# Altium project QUTMS-PDM-V00.PrjPcb (part 2 of 2)
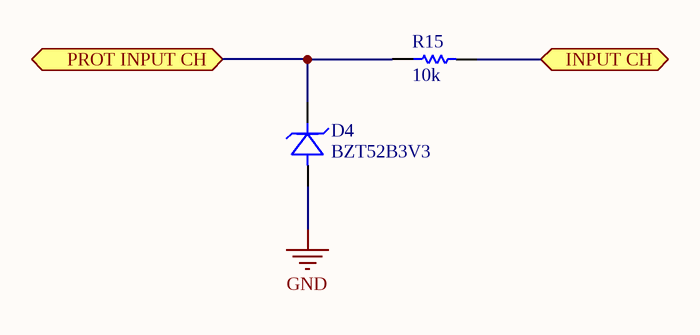
[diagram p12: PDM-S12-V00-InputProtection.SchDoc]

## Nets that join several sheets
3V3: PDM-S04-V00-Microcontroller (21 pins), PDM-S06-V00-CAN (C17.2 J3.1 U5.3), PDM-S03-V00-PSU (5 pins), PDM-S02-V00-BatteryProtection (C1.2 U1.6), PDM-S07-V00-PDMCConnectorInterface/PDM-S08-V00-PDMCConnector1 (H1A.F5), PDM-S07-V00-PDMCConnectorInterface/PDM-S08-V00-PDMCConnector2 (H1B.F5), PDM-S07-V00-PDMCConnectorInterface/PDM-S08-V00-PDMCConnector3 (H1C.F5), PDM-S07-V00-PDMCConnectorInterface/PDM-S08-V00-PDMCConnector4 (H1D.F5), PDM-S07-V00-PDMCConnectorInterface/PDM-S08-V00-PDMCConnector5 (H1E.F5), PDM-S07-V00-PDMCConnectorInterface/PDM-S08-V00-PDMCConnector6 (H1F.F5), PDM-S07-V00-PDMCConnectorInterface/PDM-S08-V00-PDMCConnector7 (H1G.F5), PDM-S07-V00-PDMCConnectorInterface/PDM-S08-V00-PDMCConnector8 (H1H.F5), PDM-S05-V00-TempSensor (C16.2 U4.4), PDM-S10-V00-SDCard (R14.2 SD1.4), PDM-S11-V00-IMU (5 pins)
AGND: PDM-S04-V00-Microcontroller (C13.1 C14.1 R5.2 U3.20), PDM-S07-V00-PDMCConnectorInterface/PDM-S08-V00-PDMCConnector1 (H1A.E7), PDM-S07-V00-PDMCConnectorInterface/PDM-S08-V00-PDMCConnector2 (H1B.E7), PDM-S07-V00-PDMCConnectorInterface/PDM-S08-V00-PDMCConnector3 (H1C.E7), PDM-S07-V00-PDMCConnectorInterface/PDM-S08-V00-PDMCConnector4 (H1D.E7), PDM-S07-V00-PDMCConnectorInterface/PDM-S08-V00-PDMCConnector5 (H1E.E7), PDM-S07-V00-PDMCConnectorInterface/PDM-S08-V00-PDMCConnector6 (H1F.E7), PDM-S07-V00-PDMCConnectorInterface/PDM-S08-V00-PDMCConnector7 (H1G.E7), PDM-S07-V00-PDMCConnectorInterface/PDM-S08-V00-PDMCConnector8 (H1H.E7)
GND: PDM-S04-V00-Microcontroller (25 pins), PDM-S06-V00-CAN (C17.1 D3.3 U5.2 U5.8), PDM-S09-V00-HarnessConnector (24 pins), PDM-S03-V00-PSU (9 pins), PDM-S02-V00-BatteryProtection (5 pins), PDM-S07-V00-PDMCConnectorInterface/PDM-S08-V00-PDMCConnector1 (H1A.E6 H1A.F6), PDM-S07-V00-PDMCConnectorInterface/PDM-S08-V00-PDMCConnector2 (H1B.E6 H1B.F6), PDM-S07-V00-PDMCConnectorInterface/PDM-S08-V00-PDMCConnector3 (H1C.E6 H1C.F6), PDM-S07-V00-PDMCConnectorInterface/PDM-S08-V00-PDMCConnector4 (H1D.E6 H1D.F6), PDM-S07-V00-PDMCConnectorInterface/PDM-S08-V00-PDMCConnector5 (H1E.E6 H1E.F6), PDM-S07-V00-PDMCConnectorInterface/PDM-S08-V00-PDMCConnector6 (H1F.E6 H1F.F6), PDM-S07-V00-PDMCConnectorInterface/PDM-S08-V00-PDMCConnector7 (H1G.E6 H1G.F6), PDM-S07-V00-PDMCConnectorInterface/PDM-S08-V00-PDMCConnector8 (H1H.E6 H1H.F6), PDM-S05-V00-TempSensor (C16.1 U4.1 U4.2 U4.5), PDM-S10-V00-SDCard (5 pins), PDM-S11-V00-IMU (5 pins), PDM-S12-V00-InputProtection (D4.A)
VCC: PDM-S03-V00-PSU (C3.2 C4.2 U2.4 U2.5), PDM-S02-V00-BatteryProtection (R1.2 U1.9), PDM-S07-V00-PDMCConnectorInterface/PDM-S08-V00-PDMCConnector1 (8 pins), PDM-S07-V00-PDMCConnectorInterface/PDM-S08-V00-PDMCConnector2 (8 pins), PDM-S07-V00-PDMCConnectorInterface/PDM-S08-V00-PDMCConnector3 (8 pins), PDM-S07-V00-PDMCConnectorInterface/PDM-S08-V00-PDMCConnector4 (8 pins), PDM-S07-V00-PDMCConnectorInterface/PDM-S08-V00-PDMCConnector5 (8 pins), PDM-S07-V00-PDMCConnectorInterface/PDM-S08-V00-PDMCConnector6 (8 pins), PDM-S07-V00-PDMCConnectorInterface/PDM-S08-V00-PDMCConnector7 (8 pins), PDM-S07-V00-PDMCConnectorInterface/PDM-S08-V00-PDMCConnector8 (8 pins)
ANALOG OUT: PDM-S04-V00-Microcontroller (U3.23), PDM-S07-V00-PDMCConnectorInterface/PDM-S08-V00-PDMCConnector1 (H1A.F7)
ANALOG OUT: PDM-S04-V00-Microcontroller (U3.24), PDM-S07-V00-PDMCConnectorInterface/PDM-S08-V00-PDMCConnector6 (H1F.F7)
ANALOG OUT: PDM-S04-V00-Microcontroller (U3.25), PDM-S07-V00-PDMCConnectorInterface/PDM-S08-V00-PDMCConnector7 (H1G.F7)
ANALOG OUT: PDM-S04-V00-Microcontroller (U3.15), PDM-S07-V00-PDMCConnectorInterface/PDM-S08-V00-PDMCConnector8 (H1H.F7)
ANALOG OUT: PDM-S04-V00-Microcontroller (U3.16), PDM-S07-V00-PDMCConnectorInterface/PDM-S08-V00-PDMCConnector3 (H1C.F7)
ANALOG OUT: PDM-S04-V00-Microcontroller (U3.17), PDM-S07-V00-PDMCConnectorInterface/PDM-S08-V00-PDMCConnector4 (H1D.F7)
ANALOG OUT: PDM-S04-V00-Microcontroller (U3.18), PDM-S07-V00-PDMCConnectorInterface/PDM-S08-V00-PDMCConnector2 (H1B.F7)
ANALOG OUT: PDM-S04-V00-Microcontroller (U3.19), PDM-S07-V00-PDMCConnectorInterface/PDM-S08-V00-PDMCConnector5 (H1E.F7)
CAN H: PDM-S06-V00-CAN (D3.2 J4.1 U5.7), PDM-S09-V00-HarnessConnector (J5.B24)
CAN L: PDM-S06-V00-CAN (D3.1 R13.1 U5.6), PDM-S09-V00-HarnessConnector (J5.B18)
CAN RX: PDM-S04-V00-Microcontroller (J1.1 U3.81), PDM-S06-V00-CAN (R12.1 U5.4)
CAN TX: PDM-S04-V00-Microcontroller (J1.2 U3.82), PDM-S06-V00-CAN (R11.1 U5.1)
CS: PDM-S04-V00-Microcontroller (U3.35), PDM-S07-V00-PDMCConnectorInterface/PDM-S08-V00-PDMCConnector2 (H1B.E2)
CS: PDM-S04-V00-Microcontroller (U3.36), PDM-S07-V00-PDMCConnectorInterface/PDM-S08-V00-PDMCConnector5 (H1E.E2)
CS: PDM-S04-V00-Microcontroller (U3.47), PDM-S07-V00-PDMCConnectorInterface/PDM-S08-V00-PDMCConnector7 (H1G.E2)
CS: PDM-S04-V00-Microcontroller (U3.48), PDM-S07-V00-PDMCConnectorInterface/PDM-S08-V00-PDMCConnector6 (H1F.E2)
CS: PDM-S04-V00-Microcontroller (U3.38), PDM-S07-V00-PDMCConnectorInterface/PDM-S08-V00-PDMCConnector1 (H1A.E2)
CS: PDM-S04-V00-Microcontroller (U3.40), PDM-S07-V00-PDMCConnectorInterface/PDM-S08-V00-PDMCConnector4 (H1D.E2)
CS: PDM-S04-V00-Microcontroller (U3.43), PDM-S07-V00-PDMCConnectorInterface/PDM-S08-V00-PDMCConnector3 (H1C.E2)
CS: PDM-S04-V00-Microcontroller (U3.46), PDM-S07-V00-PDMCConnectorInterface/PDM-S08-V00-PDMCConnector8 (H1H.E2)
IMU INT1: PDM-S04-V00-Microcontroller (U3.2), PDM-S11-V00-IMU (U6.4)
IMU INT2: PDM-S04-V00-Microcontroller (U3.1), PDM-S11-V00-IMU (U6.9)
INPUT CH1: PDM-S04-V00-Microcontroller (R22.2), PDM-S09-V00-HarnessConnector (J5.A16)
INPUT CH2: PDM-S04-V00-Microcontroller (R23.2), PDM-S09-V00-HarnessConnector (J5.A14)
LHI: PDM-S04-V00-Microcontroller (U3.44), PDM-S07-V00-PDMCConnectorInterface/PDM-S08-V00-PDMCConnector1 (H1A.E3), PDM-S07-V00-PDMCConnectorInterface/PDM-S08-V00-PDMCConnector2 (H1B.E3), PDM-S07-V00-PDMCConnectorInterface/PDM-S08-V00-PDMCConnector3 (H1C.E3), PDM-S07-V00-PDMCConnectorInterface/PDM-S08-V00-PDMCConnector4 (H1D.E3), PDM-S07-V00-PDMCConnectorInterface/PDM-S08-V00-PDMCConnector5 (H1E.E3), PDM-S07-V00-PDMCConnectorInterface/PDM-S08-V00-PDMCConnector6 (H1F.E3), PDM-S07-V00-PDMCConnectorInterface/PDM-S08-V00-PDMCConnector7 (H1G.E3), PDM-S07-V00-PDMCConnectorInterface/PDM-S08-V00-PDMCConnector8 (H1H.E3)
MISO: PDM-S04-V00-Microcontroller (J1.9 U3.53), PDM-S07-V00-PDMCConnectorInterface/PDM-S08-V00-PDMCConnector1 (H1A.F1), PDM-S07-V00-PDMCConnectorInterface/PDM-S08-V00-PDMCConnector2 (H1B.F1), PDM-S07-V00-PDMCConnectorInterface/PDM-S08-V00-PDMCConnector3 (H1C.F1), PDM-S07-V00-PDMCConnectorInterface/PDM-S08-V00-PDMCConnector4 (H1D.F1), PDM-S07-V00-PDMCConnectorInterface/PDM-S08-V00-PDMCConnector5 (H1E.F1), PDM-S07-V00-PDMCConnectorInterface/PDM-S08-V00-PDMCConnector6 (H1F.F1), PDM-S07-V00-PDMCConnectorInterface/PDM-S08-V00-PDMCConnector7 (H1G.F1), PDM-S07-V00-PDMCConnectorInterface/PDM-S08-V00-PDMCConnector8 (H1H.F1)
MISO: PDM-S04-V00-Microcontroller (J7.4 U3.79), PDM-S10-V00-SDCard (SD1.7)
MOSI: PDM-S04-V00-Microcontroller (J1.7 U3.54), PDM-S07-V00-PDMCConnectorInterface/PDM-S08-V00-PDMCConnector1 (H1A.F2), PDM-S07-V00-PDMCConnectorInterface/PDM-S08-V00-PDMCConnector2 (H1B.F2), PDM-S07-V00-PDMCConnectorInterface/PDM-S08-V00-PDMCConnector3 (H1C.F2), PDM-S07-V00-PDMCConnectorInterface/PDM-S08-V00-PDMCConnector4 (H1D.F2), PDM-S07-V00-PDMCConnectorInterface/PDM-S08-V00-PDMCConnector5 (H1E.F2), PDM-S07-V00-PDMCConnectorInterface/PDM-S08-V00-PDMCConnector6 (H1F.F2), PDM-S07-V00-PDMCConnectorInterface/PDM-S08-V00-PDMCConnector7 (H1G.F2), PDM-S07-V00-PDMCConnectorInterface/PDM-S08-V00-PDMCConnector8 (H1H.F2)
MOSI: PDM-S04-V00-Microcontroller (J7.6 U3.80), PDM-S10-V00-SDCard (SD1.3)
OPEN LOAD: PDM-S04-V00-Microcontroller (U3.26), PDM-S07-V00-PDMCConnectorInterface/PDM-S08-V00-PDMCConnector8 (H1H.E5)
OPEN LOAD: PDM-S04-V00-Microcontroller (U3.29), PDM-S07-V00-PDMCConnectorInterface/PDM-S08-V00-PDMCConnector4 (H1D.E5)
OPEN LOAD: PDM-S04-V00-Microcontroller (U3.30), PDM-S07-V00-PDMCConnectorInterface/PDM-S08-V00-PDMCConnector2 (H1B.E5)
OPEN LOAD: PDM-S04-V00-Microcontroller (U3.31), PDM-S07-V00-PDMCConnectorInterface/PDM-S08-V00-PDMCConnector5 (H1E.E5)
OPEN LOAD: PDM-S04-V00-Microcontroller (U3.32), PDM-S07-V00-PDMCConnectorInterface/PDM-S08-V00-PDMCConnector1 (H1A.E5)
OPEN LOAD: PDM-S04-V00-Microcontroller (U3.33), PDM-S07-V00-PDMCConnectorInterface/PDM-S08-V00-PDMCConnector6 (H1F.E5)
OPEN LOAD: PDM-S04-V00-Microcontroller (U3.34), PDM-S07-V00-PDMCConnectorInterface/PDM-S08-V00-PDMCConnector7 (H1G.E5)
OPEN LOAD: PDM-S04-V00-Microcontroller (U3.27), PDM-S07-V00-PDMCConnectorInterface/PDM-S08-V00-PDMCConnector3 (H1C.E5)
PDMC CH1: PDM-S09-V00-HarnessConnector (J5.B8), PDM-S07-V00-PDMCConnectorInterface/PDM-S08-V00-PDMCConnector1 (H1A.A1 H1A.A2)
PDMC CH1: PDM-S09-V00-HarnessConnector (J5.A17), PDM-S07-V00-PDMCConnectorInterface/PDM-S08-V00-PDMCConnector2 (H1B.A1 H1B.A2)
PDMC CH1: PDM-S09-V00-HarnessConnector (J5.A2), PDM-S07-V00-PDMCConnectorInterface/PDM-S08-V00-PDMCConnector3 (H1C.A1 H1C.A2)
PDMC CH1: PDM-S09-V00-HarnessConnector (J5.A6), PDM-S07-V00-PDMCConnectorInterface/PDM-S08-V00-PDMCConnector4 (H1D.A1 H1D.A2)
PDMC CH1: PDM-S09-V00-HarnessConnector (J5.A33), PDM-S07-V00-PDMCConnectorInterface/PDM-S08-V00-PDMCConnector5 (H1E.A1 H1E.A2)
PDMC CH1: PDM-S09-V00-HarnessConnector (J5.B5), PDM-S07-V00-PDMCConnectorInterface/PDM-S08-V00-PDMCConnector6 (H1F.A1 H1F.A2)
PDMC CH1: PDM-S09-V00-HarnessConnector (J5.B19), PDM-S07-V00-PDMCConnectorInterface/PDM-S08-V00-PDMCConnector7 (H1G.A1 H1G.A2)
PDMC CH1: PDM-S09-V00-HarnessConnector (J5.A27), PDM-S07-V00-PDMCConnectorInterface/PDM-S08-V00-PDMCConnector8 (H1H.A1 H1H.A2)
PDMC CH2: PDM-S09-V00-HarnessConnector (J5.B1), PDM-S07-V00-PDMCConnectorInterface/PDM-S08-V00-PDMCConnector1 (H1A.A3 H1A.A4)
PDMC CH2: PDM-S09-V00-HarnessConnector (J5.A9), PDM-S07-V00-PDMCConnectorInterface/PDM-S08-V00-PDMCConnector2 (H1B.A3 H1B.A4)
PDMC CH2: PDM-S09-V00-HarnessConnector (J5.A1), PDM-S07-V00-PDMCConnectorInterface/PDM-S08-V00-PDMCConnector3 (H1C.A3 H1C.A4)
PDMC CH2: PDM-S09-V00-HarnessConnector (J5.A5), PDM-S07-V00-PDMCConnectorInterface/PDM-S08-V00-PDMCConnector4 (H1D.A3 H1D.A4)
PDMC CH2: PDM-S09-V00-HarnessConnector (J5.B20), PDM-S07-V00-PDMCConnectorInterface/PDM-S08-V00-PDMCConnector5 (H1E.A3 H1E.A4)
PDMC CH2: PDM-S09-V00-HarnessConnector (J5.B4), PDM-S07-V00-PDMCConnectorInterface/PDM-S08-V00-PDMCConnector6 (H1F.A3 H1F.A4)
PDMC CH2: PDM-S09-V00-HarnessConnector (J5.B13), PDM-S07-V00-PDMCConnectorInterface/PDM-S08-V00-PDMCConnector7 (H1G.A3 H1G.A4)
PDMC CH2: PDM-S09-V00-HarnessConnector (J5.A26), PDM-S07-V00-PDMCConnectorInterface/PDM-S08-V00-PDMCConnector8 (H1H.A3 H1H.A4)
PDMC CH3: PDM-S09-V00-HarnessConnector (J5.B3), PDM-S07-V00-PDMCConnectorInterface/PDM-S08-V00-PDMCConnector1 (H1A.B3 H1A.B4)
PDMC CH3: PDM-S09-V00-HarnessConnector (J5.A25), PDM-S07-V00-PDMCConnectorInterface/PDM-S08-V00-PDMCConnector2 (H1B.B3 H1B.B4)
PDMC CH3: PDM-S09-V00-HarnessConnector (J5.A3), PDM-S07-V00-PDMCConnectorInterface/PDM-S08-V00-PDMCConnector3 (H1C.B3 H1C.B4)
PDMC CH3: PDM-S09-V00-HarnessConnector (J5.A7), PDM-S07-V00-PDMCConnectorInterface/PDM-S08-V00-PDMCConnector4 (H1D.B3 H1D.B4)
PDMC CH3: PDM-S09-V00-HarnessConnector (J5.B14), PDM-S07-V00-PDMCConnectorInterface/PDM-S08-V00-PDMCConnector5 (H1E.B3 H1E.B4)
PDMC CH3: PDM-S09-V00-HarnessConnector (J5.B7), PDM-S07-V00-PDMCConnectorInterface/PDM-S08-V00-PDMCConnector6 (H1F.B3 H1F.B4)
PDMC CH3: PDM-S09-V00-HarnessConnector (J5.B26), PDM-S07-V00-PDMCConnectorInterface/PDM-S08-V00-PDMCConnector7 (H1G.B3 H1G.B4)
PDMC CH3: PDM-S09-V00-HarnessConnector (J5.A10), PDM-S07-V00-PDMCConnectorInterface/PDM-S08-V00-PDMCConnector8 (H1H.B3 H1H.B4)
PDMC CH4: PDM-S09-V00-HarnessConnector (J5.B2), PDM-S07-V00-PDMCConnectorInterface/PDM-S08-V00-PDMCConnector1 (H1A.B1 H1A.B2)
PDMC CH4: PDM-S09-V00-HarnessConnector (J5.A34), PDM-S07-V00-PDMCConnectorInterface/PDM-S08-V00-PDMCConnector2 (H1B.B1 H1B.B2)
PDMC CH4: PDM-S09-V00-HarnessConnector (J5.A4), PDM-S07-V00-PDMCConnectorInterface/PDM-S08-V00-PDMCConnector3 (H1C.B1 H1C.B2)
PDMC CH4: PDM-S09-V00-HarnessConnector (J5.A8), PDM-S07-V00-PDMCConnectorInterface/PDM-S08-V00-PDMCConnector4 (H1D.B1 H1D.B2)
PDMC CH4: PDM-S09-V00-HarnessConnector (J5.B21), PDM-S07-V00-PDMCConnectorInterface/PDM-S08-V00-PDMCConnector5 (H1E.B1 H1E.B2)
PDMC CH4: PDM-S09-V00-HarnessConnector (J5.B6), PDM-S07-V00-PDMCConnectorInterface/PDM-S08-V00-PDMCConnector6 (H1F.B1 H1F.B2)
PDMC CH4: PDM-S09-V00-HarnessConnector (J5.B25), PDM-S07-V00-PDMCConnectorInterface/PDM-S08-V00-PDMCConnector7 (H1G.B1 H1G.B2)
PDMC CH4: PDM-S09-V00-HarnessConnector (J5.A18), PDM-S07-V00-PDMCConnectorInterface/PDM-S08-V00-PDMCConnector8 (H1H.B1 H1H.B2)
S0: PDM-S04-V00-Microcontroller (U3.45), PDM-S07-V00-PDMCConnectorInterface/PDM-S08-V00-PDMCConnector1 (H1A.F3), PDM-S07-V00-PDMCConnectorInterface/PDM-S08-V00-PDMCConnector2 (H1B.F3), PDM-S07-V00-PDMCConnectorInterface/PDM-S08-V00-PDMCConnector3 (H1C.F3), PDM-S07-V00-PDMCConnectorInterface/PDM-S08-V00-PDMCConnector4 (H1D.F3), PDM-S07-V00-PDMCConnectorInterface/PDM-S08-V00-PDMCConnector5 (H1E.F3), PDM-S07-V00-PDMCConnectorInterface/PDM-S08-V00-PDMCConnector6 (H1F.F3), PDM-S07-V00-PDMCConnectorInterface/PDM-S08-V00-PDMCConnector7 (H1G.F3), PDM-S07-V00-PDMCConnectorInterface/PDM-S08-V00-PDMCConnector8 (H1H.F3)
S1: PDM-S04-V00-Microcontroller (U3.42), PDM-S07-V00-PDMCConnectorInterface/PDM-S08-V00-PDMCConnector1 (H1A.F4), PDM-S07-V00-PDMCConnectorInterface/PDM-S08-V00-PDMCConnector2 (H1B.F4), PDM-S07-V00-PDMCConnectorInterface/PDM-S08-V00-PDMCConnector3 (H1C.F4), PDM-S07-V00-PDMCConnectorInterface/PDM-S08-V00-PDMCConnector4 (H1D.F4), PDM-S07-V00-PDMCConnectorInterface/PDM-S08-V00-PDMCConnector5 (H1E.F4), PDM-S07-V00-PDMCConnectorInterface/PDM-S08-V00-PDMCConnector6 (H1F.F4), PDM-S07-V00-PDMCConnectorInterface/PDM-S08-V00-PDMCConnector7 (H1G.F4), PDM-S07-V00-PDMCConnectorInterface/PDM-S08-V00-PDMCConnector8 (H1H.F4)
S2: PDM-S04-V00-Microcontroller (U3.39), PDM-S07-V00-PDMCConnectorInterface/PDM-S08-V00-PDMCConnector1 (H1A.E4), PDM-S07-V00-PDMCConnectorInterface/PDM-S08-V00-PDMCConnector2 (H1B.E4), PDM-S07-V00-PDMCConnectorInterface/PDM-S08-V00-PDMCConnector3 (H1C.E4), PDM-S07-V00-PDMCConnectorInterface/PDM-S08-V00-PDMCConnector4 (H1D.E4), PDM-S07-V00-PDMCConnectorInterface/PDM-S08-V00-PDMCConnector5 (H1E.E4), PDM-S07-V00-PDMCConnectorInterface/PDM-S08-V00-PDMCConnector6 (H1F.E4), PDM-S07-V00-PDMCConnectorInterface/PDM-S08-V00-PDMCConnector7 (H1G.E4), PDM-S07-V00-PDMCConnectorInterface/PDM-S08-V00-PDMCConnector8 (H1H.E4)
SCK: PDM-S04-V00-Microcontroller (J1.8 U3.52), PDM-S07-V00-PDMCConnectorInterface/PDM-S08-V00-PDMCConnector1 (H1A.E1), PDM-S07-V00-PDMCConnectorInterface/PDM-S08-V00-PDMCConnector2 (H1B.E1), PDM-S07-V00-PDMCConnectorInterface/PDM-S08-V00-PDMCConnector3 (H1C.E1), PDM-S07-V00-PDMCConnectorInterface/PDM-S08-V00-PDMCConnector4 (H1D.E1), PDM-S07-V00-PDMCConnectorInterface/PDM-S08-V00-PDMCConnector5 (H1E.E1), PDM-S07-V00-PDMCConnectorInterface/PDM-S08-V00-PDMCConnector6 (H1F.E1), PDM-S07-V00-PDMCConnectorInterface/PDM-S08-V00-PDMCConnector7 (H1G.E1), PDM-S07-V00-PDMCConnectorInterface/PDM-S08-V00-PDMCConnector8 (H1H.E1)
SCK: PDM-S04-V00-Microcontroller (J7.2 U3.78), PDM-S10-V00-SDCard (SD1.5)
SCL: PDM-S04-V00-Microcontroller (J1.5 R7.1 U3.95), PDM-S02-V00-BatteryProtection (U1.5), PDM-S11-V00-IMU (U6.13)
SDA: PDM-S04-V00-Microcontroller (J1.3 R8.1 U3.96), PDM-S02-V00-BatteryProtection (U1.4), PDM-S11-V00-IMU (U6.14)
SPI2 SS: PDM-S04-V00-Microcontroller (J7.8 U3.77), PDM-S10-V00-SDCard (R14.1 SD1.2)
TEMP SENSE: PDM-S04-V00-Microcontroller (U3.37), PDM-S05-V00-TempSensor (U4.3)